# Altium project PCB_Project.PrjPcb
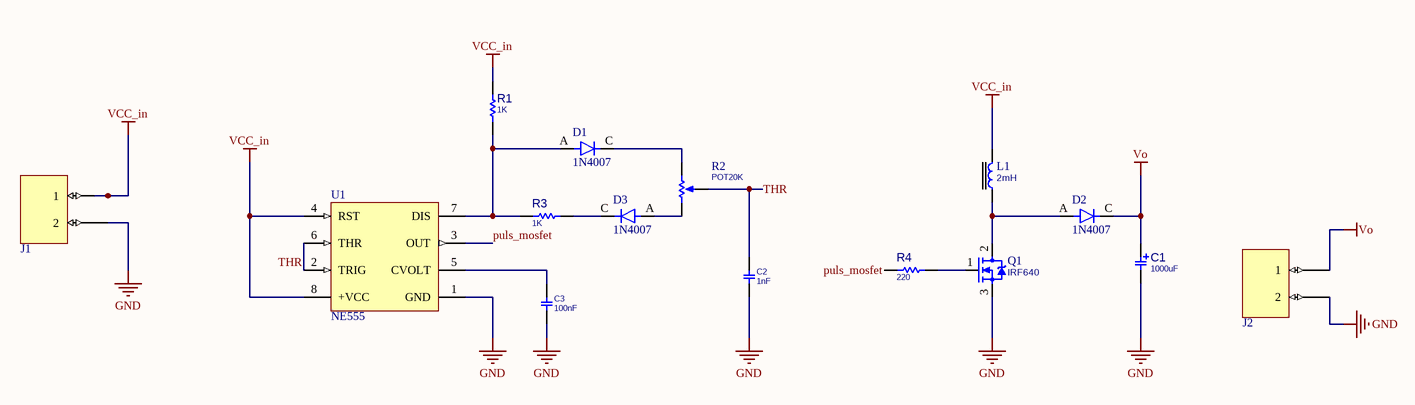
[diagram p0: Sheet1.SchDoc]
1 sheet, 15 parts. Net scope: global (net labels, ports and power ports of the same name join across sheets).
Board files: PCB1.PcbDoc, PCB2_250.PcbDoc

## Sheet Sheet1.SchDoc
size A4; SheetNumber: 1; SheetTotal: 1

### Parts
C1  1000uF  [C_EL_8X12]
C2  1nF  [C_CER_D3]
C3  100nF  [C_CER_D3]
D1  1N4007  [DIOAD1060W80L520D270]
D2  1N4007  [DIOAD1060W80L520D270]
D3  1N4007  [DIOAD1060W80L520D270]
J1  con_x2  [TBG_2]  (value not drawn)  (net tie)
J2  con_x2  [TBG_2]  (value not drawn)  (net tie)
L1  2mH  [C_EL_10X20]
Q1  IRF640  [TO220_3]
R1  1K  [R025W_AX04]
R2  POT20K  [POT_7X5]
R3  1K  [R025W_AX04]
R4  220  [R025W_AX04]
U1  NE555  [NE555]

### Nets
GND: C1.2 C2.1 C3.1 J1.2 J2.2 Q1.3(S) U1.1(GND)
VCC_in: J1.1 L1.2 R1.2 U1.4(RST) U1.8(+VCC)
Vo: C1.1 D2.C J2.1
puls_mosfet: R4.2 U1.3(OUT)
THR: C2.2 R2.2(TAP) U1.2(TRIG) U1.6(THR)
NetC3_2: C3.2 U1.5(CVOLT)
NetD1_A: D1.A R1.1 R3.2 U1.7(DIS)
NetD1_C: D1.C R2.3(BOT)
NetD2_A: D2.A L1.1 Q1.2(D)
NetD3_A: D3.A R2.1(TOP)
NetD3_C: D3.C R3.1
NetQ1_1: Q1.1(G) R4.1

### Library data of the parts
C1 = CAP_THD_EL_10X20: CAP, THD, ELEC,; MANF_P#: MANF_PART#; PARAM2: 25V; DESC: DESCRIPTION; DIST#: MOUSER; PARAM: 20%; PRICE: 10= 5$; MANF: MANF; ASSEMBLY: ASSEMBLY; VALUE: 1000uF
C2 C3 = CAP_THD_CERML: CAP, THD, CER MULTI LAYER,; DESC: CAP, CER MULTI LAYER,; MANF_P#: MANF_PART#; PARAM2: 50V; PRICE: 100= 1$; MANF: MANF; ASSEMBLY: ASSEMBLY
  C2: VALUE: 1nF
  C3: VALUE: 100nF
D1-D3 = 1N4007: Diode Standard 1000 V 1A Through Hole DO-41; MF: NTE Electronics, Inc.; Package: DO-41 NTE Electronics; Check_prices: https://www.snapeda.com/parts/1N4007/NTE+Electronics/view-part/?ref=eda; Value: *; Purchase-URL: https://pricing.snapeda.com/search/part/1N4007/?ref=eda; Availability: In Stock; SnapEDA_Link: https://www.snapeda.com/parts/1N4007/NTE+Electronics/view-part/?ref=snap; MP: 1N4007; Price: None
L1 = IND_THD: INDUCTOR, THD; VALUE: 2mH
Q1 = MOSN_IRF640_TO220: MOSFET, N-CH, 0.15RDS, 18A, 300VDS, 2~4VGSth; PARAM2: 200VDS, 2~4VGSth; PARAM: 0.15RDS, 18A, -55~175oC; MANF: VISHAY, ON; ASSEMBLY: ASSEMBLY; MANF_P#: IRF640; PRICE: 0.9$, 1500toman@PAYA; VALUE: IRF640
R1 R3 R4 = RES_THD: RESISTOR, THD; MANF_P#: RK73H1ETTP4701F; MANF: KOA SPEER; PARAM: 0.063W; DESC: DESCRIPTION; DIST#: MOUSER; PARAM2: 1%; ASSEMBLY: ASSEMBLY; PRICE: 100= 0.5$
  R1 R3: VALUE: 1K
  R4: VALUE: 220
R2 = RES_THD_POT_VOLUME: RESISTOR, THD, Potentiometer Volume; VALUE: POT20K